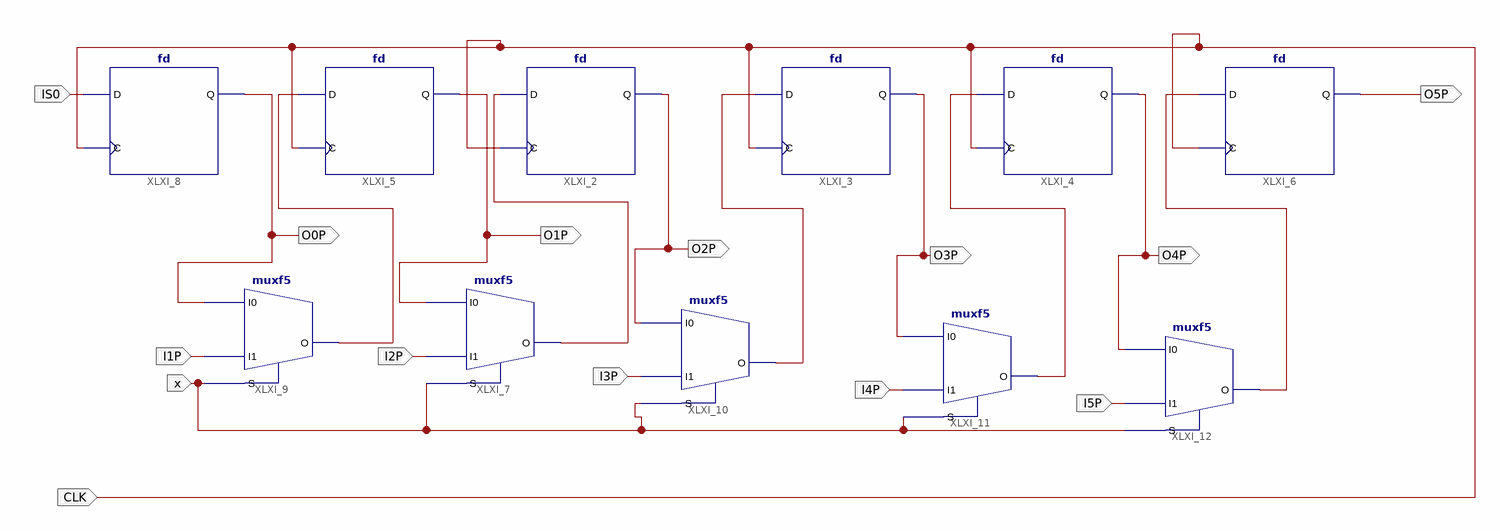
[diagram p0: schematic sheet 1]
// Xilinx ISE schematic Registro.sch (spartan3e) as structural Verilog: 11 symbols, 14 ports
module Registro (
  input  I1P,
  input  I2P,
  input  I3P,
  input  I4P,
  input  I5P,
  input  IS0,
  input  CLK,
  input  x,
  output O4P,
  output O3P,
  output O2P,
  output O0P,
  output O1P,
  output O5P
);

  wire XLXN_56, XLXN_57, XLXN_58, XLXN_59, XLXN_60;

  fd XLXI_2 (.C(CLK), .D(XLXN_57), .Q(O2P));
  fd XLXI_3 (.C(CLK), .D(XLXN_58), .Q(O3P));
  fd XLXI_4 (.C(CLK), .D(XLXN_59), .Q(O4P));
  fd XLXI_5 (.C(CLK), .D(XLXN_56), .Q(O1P));
  fd XLXI_6 (.C(CLK), .D(XLXN_60), .Q(O5P));
  muxf5 XLXI_7 (.I0(O1P), .I1(I2P), .S(x), .O(XLXN_57));
  fd XLXI_8 (.C(CLK), .D(IS0), .Q(O0P));
  muxf5 XLXI_9 (.I0(O0P), .I1(I1P), .S(x), .O(XLXN_56));
  muxf5 XLXI_10 (.I0(O2P), .I1(I3P), .S(x), .O(XLXN_58));
  muxf5 XLXI_11 (.I0(O3P), .I1(I4P), .S(x), .O(XLXN_59));
  muxf5 XLXI_12 (.I0(O4P), .I1(I5P), .S(x), .O(XLXN_60));
endmodule
